# Altium schematic sheet SingleBoardDrone_Sens.SchDoc
size B; SheetNumber: 4; SheetTotal: 5
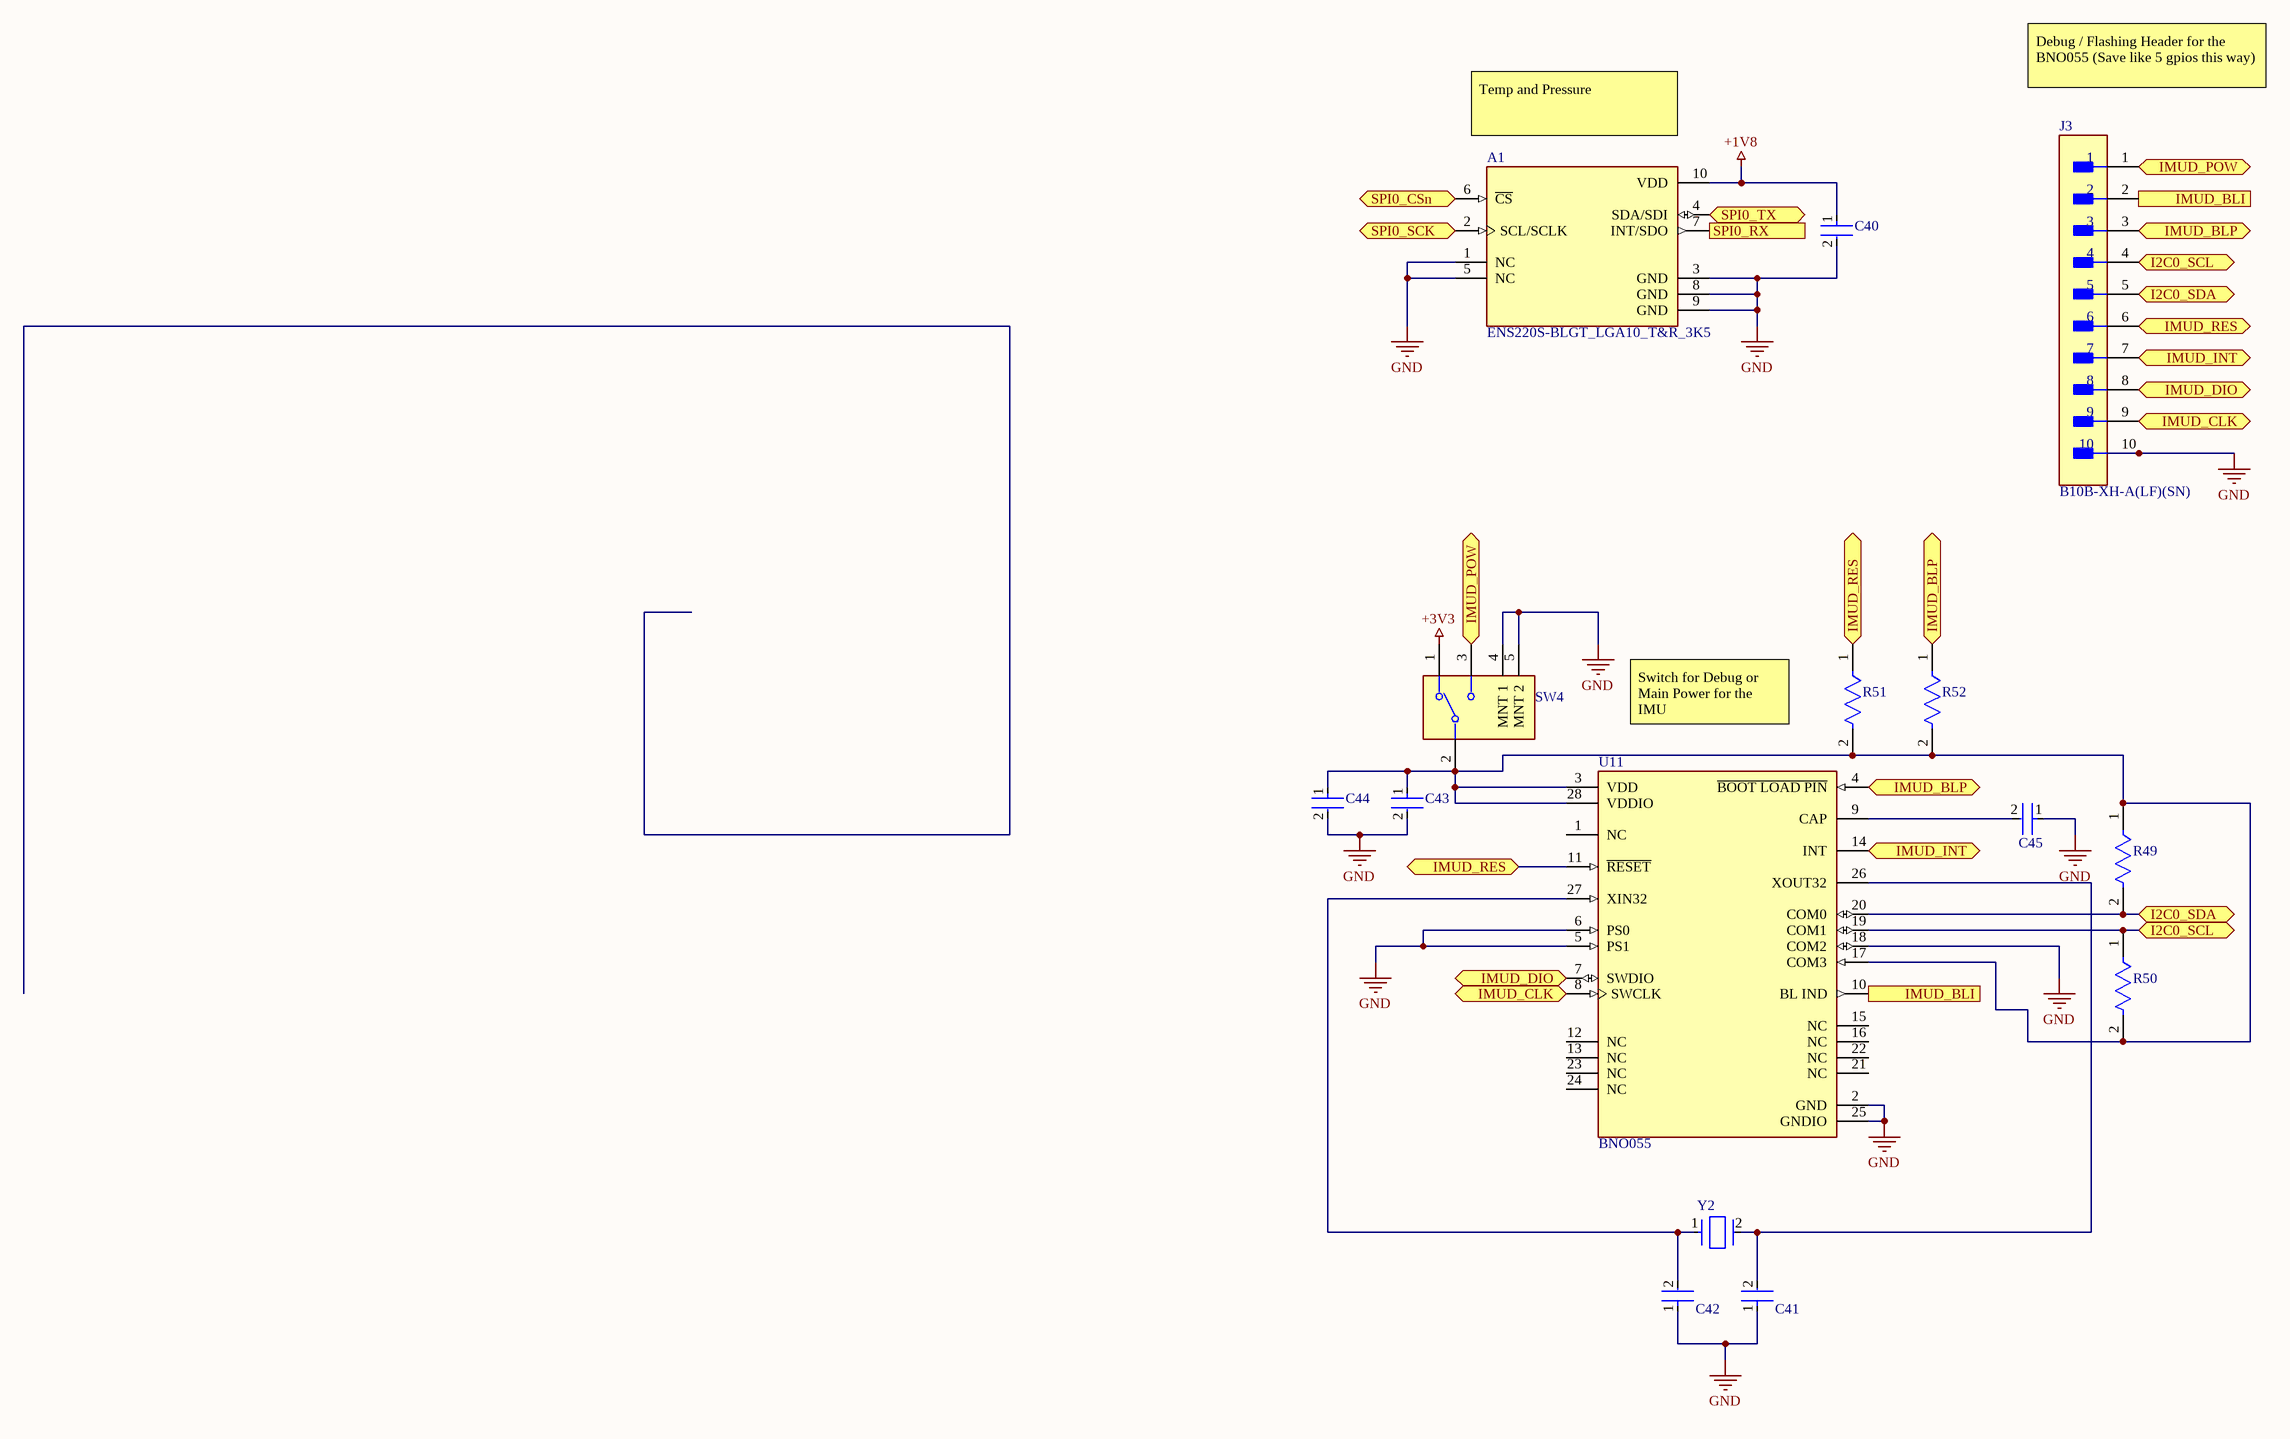
[diagram p0: SingleBoardDrone_Sens.SchDoc]

## Parts
A1  ENS220S-BLGT_LGA10_T&R_3K5  [XDCR_ENS220S-BLGT_LGA10_T&R_3K5]
C40  CL03A104KP3NNNC  [FP-CL03-IPC_C]  (value not drawn)
C41  C0805C220J5RACTU  [FP-C0805C-DN-MFG]  (value not drawn)
C42  C0805C220J5RACTU  [FP-C0805C-DN-MFG]  (value not drawn)
C43  CL03A104KP3NNNC  [FP-CL03-IPC_C]  (value not drawn)
C44  CL03A104KP3NNNC  [FP-CL03-IPC_C]  (value not drawn)
C45  CGA3E1X7R1E105K080AC  [FP-CGA3E-0_3-0_1-IPC_A]  (value not drawn)
J3  B10B-XH-A(LF)(SN)  [FP-B10B-XH-A_LF_SN-MFG]
R49  RMCF0603JG10K0  [FP-RMCF0603-MFG]  (value not drawn)
R50  RMCF0603JG10K0  [FP-RMCF0603-MFG]  (value not drawn)
R51  RMCF0603JG10K0  [FP-RMCF0603-MFG]  (value not drawn)
R52  RMCF0603JG10K0  [FP-RMCF0603-MFG]  (value not drawn)
SW4  1825232-1  [FP-1825232-1-MFG]  (value not drawn)
U11  BNO055  [FP-BNO055-MFG]
Y2  ABS07-32.768KHZ-T  [FP-ABS07-MFG]  (value not drawn)

## Ports
I2C0_SCL (bidir, see SingleBoardDrone_RP2350[3B], SingleBoardDrone_Sens[3A]), I2C0_SCL (bidir, see SingleBoardDrone_RP2350[3B], SingleBoardDrone_Sens[3C]), I2C0_SDA (bidir, see SingleBoardDrone_RP2350[3B], SingleBoardDrone_Sens[3A]), I2C0_SDA (bidir, see SingleBoardDrone_RP2350[3B], SingleBoardDrone_Sens[3C]), IMUD_BLI (out, see SingleBoardDrone_Sens[2C]), IMUD_BLI (out, see SingleBoardDrone_Sens[3A]), IMUD_BLP (bidir, see SingleBoardDrone_Sens[2B], SingleBoardDrone_Sens[2C]), IMUD_BLP (bidir, see SingleBoardDrone_Sens[2B], SingleBoardDrone_Sens[3A]), IMUD_BLP (bidir, see SingleBoardDrone_Sens[2C], SingleBoardDrone_Sens[3A]), IMUD_CLK (bidir, see SingleBoardDrone_Sens[1C]), IMUD_CLK (bidir, see SingleBoardDrone_Sens[3B]), IMUD_DIO (bidir, see SingleBoardDrone_Sens[1C]), IMUD_DIO (bidir, see SingleBoardDrone_Sens[3B]), IMUD_INT (bidir, see SingleBoardDrone_RP2350[1A], SingleBoardDrone_Sens[2C]), IMUD_INT (bidir, see SingleBoardDrone_RP2350[1A], SingleBoardDrone_Sens[3B]), IMUD_POW (bidir, see SingleBoardDrone_Sens[1B]), IMUD_POW (bidir, see SingleBoardDrone_Sens[3A]), IMUD_RES (bidir, see SingleBoardDrone_Sens[1C], SingleBoardDrone_Sens[2B]), IMUD_RES (bidir, see SingleBoardDrone_Sens[1C], SingleBoardDrone_Sens[3B]), IMUD_RES (bidir, see SingleBoardDrone_Sens[2B], SingleBoardDrone_Sens[3B]), SPI0_CSn (bidir, see SingleBoardDrone_RP2350[1A]), SPI0_RX (out, see SingleBoardDrone_RP2350[1A]), SPI0_SCK (bidir, see SingleBoardDrone_RP2350[1A]), SPI0_TX (bidir, see SingleBoardDrone_RP2350[1A])

## Nets
+1V8: A1.10(VDD) C40.1
+3V3: SW4.1
GND: A1.1(NC) A1.3(GND) A1.5(NC) A1.8(GND) A1.9(GND) C40.2 C41.1 C42.1 C43.2 C44.2 C45.1 J3.10 SW4.4(MNT_1) SW4.5(MNT_2) U11.2(GND) U11.5(PS1) U11.6(PS0) U11.18(COM2) U11.25(GNDIO)
I2C0_SCL: J3.4 R50.1 U11.19(COM1) ; port I2C0_SCL
I2C0_SDA: J3.5 R49.2 U11.20(COM0) ; port I2C0_SDA
IMUD_BLI: J3.2 U11.10(BL_IND) ; port IMUD_BLI
IMUD_BLP: J3.3 R52.1 U11.4(~{BOOT_LOAD_PIN}) ; port IMUD_BLP
IMUD_CLK: J3.9 U11.8(SWCLK) ; port IMUD_CLK
IMUD_DIO: J3.8 U11.7(SWDIO) ; port IMUD_DIO
IMUD_INT: J3.7 U11.14(INT) ; port IMUD_INT
IMUD_POW: J3.1 SW4.3 ; port IMUD_POW
IMUD_RES: J3.6 R51.1 U11.11(~{RESET}) ; port IMUD_RES
SPI0_CSn: A1.6(~{CS}) ; port SPI0_CSn
SPI0_RX: A1.7(INT/SDO) ; port SPI0_RX
SPI0_SCK: A1.2(SCL/SCLK) ; port SPI0_SCK
SPI0_TX: A1.4(SDA/SDI) ; port SPI0_TX
NetC41_2: C41.2 U11.26(XOUT32) Y2.2
NetC42_2: C42.2 U11.27(XIN32) Y2.1
NetC43_1: C43.1 C44.1 R49.1 R50.2 R51.2 R52.2 SW4.2 U11.3(VDD) U11.17(COM3) U11.28(VDDIO)
NetC45_2: C45.2 U11.9(CAP)

Not connected (* = marked no-connect by the designer): U11 1(NC) 12(NC) 13(NC) 15(NC) 16(NC) 21(NC) 22(NC) 23(NC) 24(NC)

## Notes on the sheet
- (near A1) Temp and Pressure
- Debug / Flashing Header for the BNO055 (Save like 5 gpios this way)
- Switch for Debug or Main Power for the IMU

## Library data of the parts
A1 = ENS220S-BLGT_LGA10_T&R_3K5: Premium accuracy barometric pressure and temperature sensor for activity tracking and indoor navigation/localization; MF: ScioSense; MP: ENS220S-BLGT LGA10 T&amp;R 3K5; SnapEDA_Link: https://www.snapeda.com/parts/ENS220S-BLGT%20LGA10%20T&R%203K5/ScioSense/view-part/?ref=snap; Package: None; Value: *; Check_prices: https://www.snapeda.com/parts/ENS220S-BLGT%20LGA10%20T&R%203K5/ScioSense/view-part/?ref=eda
C40 C43 C44 = CMP-2010-00672-2: Cap Ceramic 100nF 10V X5R ±10% Pad SMD 0201 +85°C T/R; Radiation Hardening: No; Voltage Rating: 10V; Dielectric: X5R; Length: 0.6mm; Voltage Rating (DC): 10V; Package Quantity: 1; Height: 0.3mm; Width: 0.012inch; Min Operating Temperature: -55°C; Lead Free: Lead Free; Tolerance: 10%; Contact Plating: Tin; Depth: 0.3mm; Max Operating Temperature: 85°C; Case/Package: 0201; Capacitance: 100nF; Mount: Surface Mount; Thickness: 0.013inch; Case Code (Metric): 0603; Case Code (Imperial): 0201; Packaging: Tape and Reel
C41 C42 = CMP-03020-030005-1: C0805 22 pF X7R 30ppm/°C 5.00% 50 V; Manufacturer: KEMET; Voltage Rating: 50 V; Value: 22 pF; Material: Ceramic; Tolerance: 0.05; RoHS: TRUE; Temperature Range Low: -55°C; Temperature: -55°C to +125°C; Device Class L3: Ceramic Capacitors; Temperature Coefficient: 30ppm/°C; Temperature Range High: +125°C; Octopart: https://octopart.com/c0805c220j5ractu-kemet-76790706; Automotive: No; Manufacturer Part Number: C0805C220J5RACTU; ComponentLink2Description: Datasheet; Ipc Land Pattern Name: CAPC200125X78; Temperature Characteristic: X7R; Category: Cap; Package: C0805C-DN; Lead Free: Yes; Capacitance: 22 pF; Device Class L2: Capacitors; ComponentLink2URL: https://content.kemet.com/datasheets/KEM_C1003_C0G_SMD.pdf; Height: 0.88mm; Device Class L1: Passive Components
C45 = CMP-08246-001507-1: Cap Ceramic 1uF 25V X7R 10% Pad SMD 0603 +125°C Automotive T/R; Dielectric: X7R; Capacitance: 1uF; Voltage Rating: 25V; Thickness: 0.035inch; Width: 0.031inch; Ratings: AEC-Q200; Case Code (Metric): 1608; REACH SVHC: No SVHC; Voltage: 25V; Composition: Ceramic; Min Operating Temperature: -55°C; Termination: SMD/SMT; Depth: 0.8mm; Max Operating Temperature: 125°C; Mount: Surface Mount; Weight: 7.1E-05oz; Package Quantity: 4000; Tolerance: 10%; Packaging: Tape and Reel; Lead Free: Lead Free; Case/Package: 0603; Length: 1.6mm; Height: 0.8mm; Case Code (Imperial): 0603; Voltage Rating (DC): 25V
J3 = CMP-17439-000145-1: CONN HEADER VERT 10POS 2.5MM; Voltage Rating: 250V; Current Rating: 3A; Wire/Cable Gauge: 22AWG; Number of Contacts: 10; Contact Resistance: 20mR; Mated Stacking Heights: 9.8mm; Gender: Male; Insulation Resistance: 1GR; Series: XH; Max Current Rating: 3A; Contact Shape: Square; Contact Material: Brass; Housing Material: Polyamide; Lead Free: Lead Free; Orientation: Straight; Max Voltage Rating (DC): 250V; Contact Type: Male Pin; Number of Positions: 10; Length: 27.4mm; Housing Color: White; Max Voltage Rating (AC): 250V; Depth: 5.75mm; Mount: Through Hole; Pitch: 2.5mm; Fastening Type: Detent; Flammability Rating: UL94 V-0; Color: Natural; Contact Plating: Tin; Insulation Color: Natural; Packaging: Bulk; REACH SVHC: No SVHC; Insulation Material: Nylon; Connector Type: Header; Lead Pitch: 2.5mm; Contact Finish - Mating: TIN; Voltage Rating (AC): 250V; Number of Rows: 1; Max Operating Temperature: 85°C; Min Operating Temperature: -25°C; Termination: Solder
R49-R52 = CMP-26527-000153-1: 10kΩ ±5% 0.1W 0603 Thick Film Chip Resistor AEC-Q200 compliant; Temperature Coefficient: 200ppm/°C; Resistance: 10kR; Max Power Dissipation: 100mW; Tolerance: 5%; Case Code (Imperial): 0603; Series: RMCF; Resistor Type: Thick Film; Length: 0.061inch; Features: Automotive AEC-Q200; Height: 0.022inch; Case Code (Metric): 1608; Width: 0.031inch; Number of Terminations: 2; Contact Plating: Tin; Case/Package: 0603; Package Quantity: 1; Max Operating Temperature: 155°C; Mount: Surface Mount; RoHS Compliant: Yes; Radiation Hardening: No; Min Operating Temperature: -55°C; Packaging: Tape and Reel
SW4 = CMP-03405-000001-1: SWITCH SLIDE SPDT 200MA 30V; Manufacturer: TE Connectivity; Contact Current Rating: 0.2A; Contact Resistance: 20mΩ; Electromechanical Life: 10000Cycles; Operating Force: 200gf; Throw Configuration: SPDT; Manufacturer Part Number: 1825232-1; Temperature Range High: +70°C; Height: 3.7mm; ComponentLink2URL: https://www.te.com/commerce/DocumentDelivery/DDEController?Action=showdoc&DocId=Customer+Drawing%7F1825232%7FB2%7Fpdf%7FEnglish%7FENG_CD_1825232_B2.pdf%7F1825232-1; Mount: Through Hole; Mouser Description: Slide Switches SLIDE SWITCH SPDT Right Angle; Package: 1825232-1; Temperature: -20°C to +70°C; Automotive: No; ComponentLink2Description: Datasheet; Lead Free: Yes; Octopart: https://octopart.com/1825232-1-te+connectivity-45209882; Device Class L1: Electromechanical; Digikey Description: SWITCH SLIDE SPDT 200MA 30V; Device Class L3: Slide Switches; Device Class L2: Switches; Voltage Rating Dc: 30V; Temperature Range Low: -20°C; Category: Switch; RoHS: TRUE
U11 = CMP-2000-05075-4: IMU ACCEL/GYRO/MAG I2C 28LGA; Sensor Type: Accelerometer; Packaging: Tape and Reel; Case/Package: LGA; Min Operating Temperature: -40°C; Mount: Surface Mount; Output Type: I2C; Lead Free: Lead Free; Max Operating Temperature: 85°C
Y2 = CMP-0447-00001-4: Crystal 32.768kHz ±20ppm (Tol) 12.5pF FUND 70kΩ 2-Pin CSMD T/R; ESR (Equivalent Series Resistance): 70kR; Radiation Hardening: No; Frequency: 32.768kHz; Length: 3.2mm; Max Operating Temperature: 85°C; Number of Pins: 2; Series: ABS07; Min Operating Temperature: -40°C; Frequency Tolerance: 20ppm; Packaging: Tape and Reel; Height: 0.9mm; Width: 1.5mm; Depth: 1.5mm; Load Capacitance: 12.5pF; RoHS Compliant: Yes; Tolerance: 20ppm; Termination: SMD/SMT; Lead Free: Lead Free; Series Resistance: 70kR; REACH SVHC: No SVHC; Case/Package: CSMD; Operating Frequency: 32.768 kHz; Package Quantity: 3000